# Altium schematic sheet 03. MCU.SchDoc
size A4
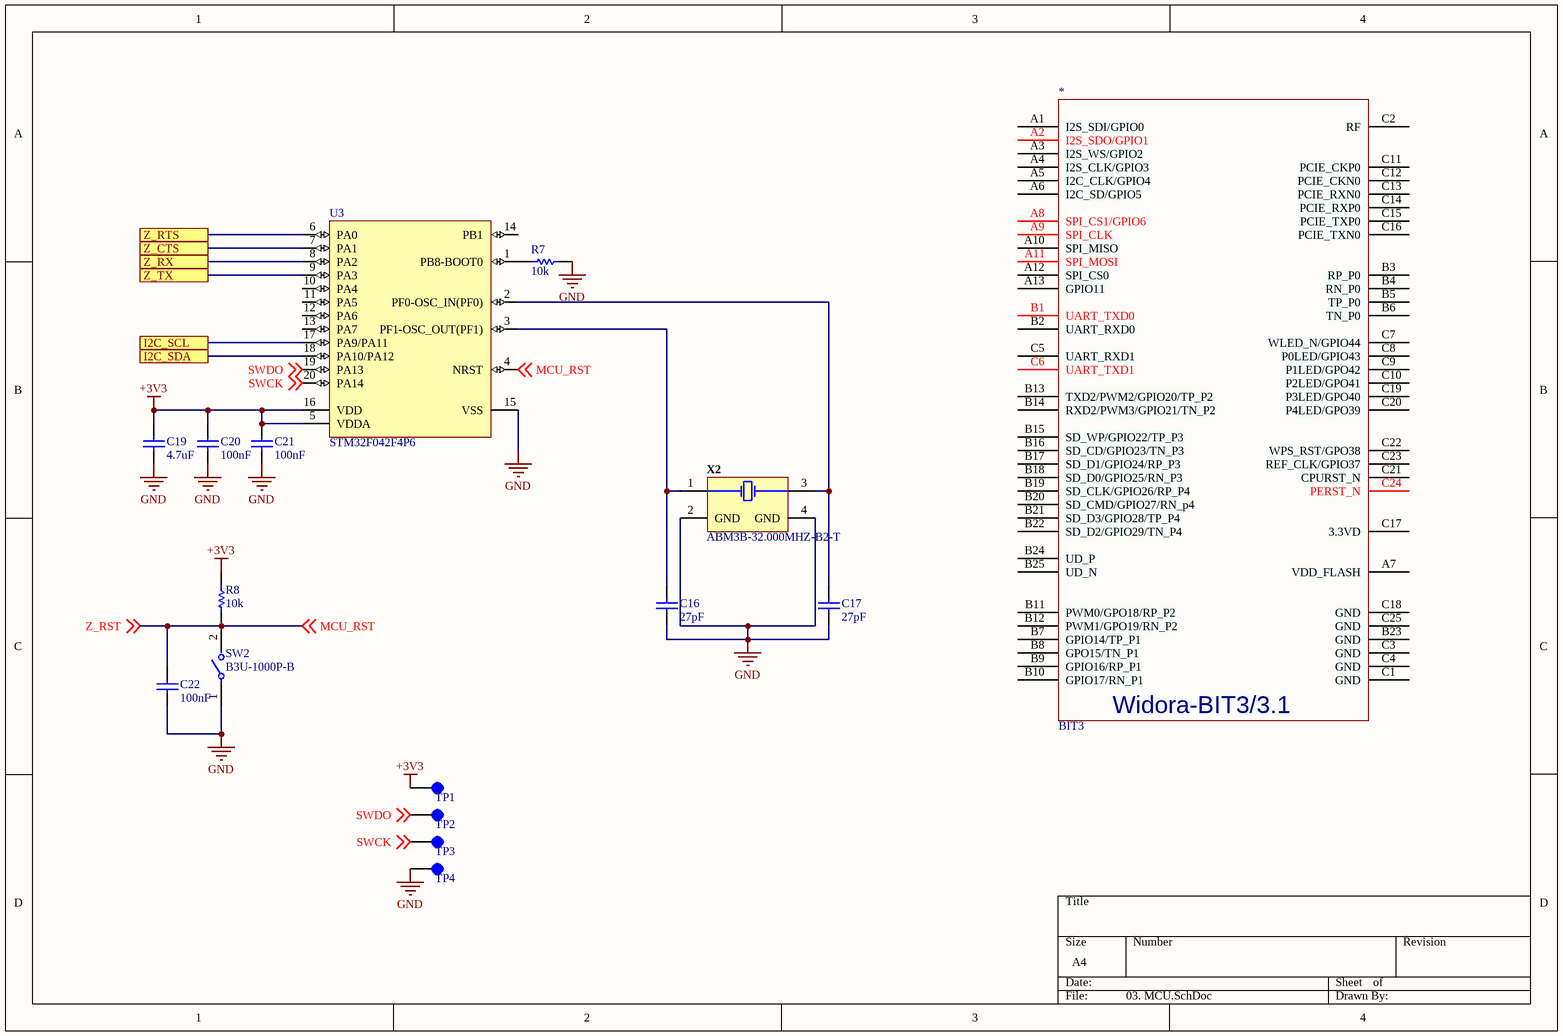
[diagram p0: 03. MCU.SchDoc]

## Parts
*  BIT3  [Widora-BIT3]
C16  27pF  [CAPC1005X56X25NL10T15]
C17  27pF  [CAPC1005X56X25NL10T15]
C19  4.7uF  [CAPC1608X90X35NL10T15]
C20  100nF  [CAPC1005X56X25NL10T15]
C21  100nF  [CAPC1005X56X25NL10T15]
C22  100nF  [CAPC1005X56X25NL10T15]
R7  10k  [RESC1005X40X25NL05T05]
R8  10k  [RESC1005X40X25NL05T05]
SW2  B3U-1000P-B  [FP-B3U-1000P-B-MFG]
TP1  Test Point  [TP]  (value not drawn)
TP2  Test Point  [TP]  (value not drawn)
TP3  Test Point  [TP]  (value not drawn)
TP4  Test Point  [TP]  (value not drawn)
U3  STM32F042F4P6  [STM-TSSOP20_M]
X2  ABM3B-32.000MHZ-B2-T  [ABRA-ABM3B_V]

## Ports
I2C_SCL, I2C_SDA, Z_CTS, Z_RTS, Z_RX, Z_TX

## Nets
+3V3: C19.2 C20.2 C21.2 R8.1 TP1.1 U3.5(VDDA) U3.16(VDD)
GND: C16.1 C17.1 C19.1 C20.1 C21.1 C22.1 R7.1 SW2.1 TP4.1 U3.15(VSS) X2.2(GND) X2.4(GND)
I2C_SCL: U3.17(PA9/PA11) ; port I2C_SCL
I2C_SDA: U3.18(PA10/PA12) ; port I2C_SDA
MCU_RST: C22.2 R8.2 SW2.2 U3.4(NRST) ; off-sheet MCU_RST, off-sheet Z_RST  [also labelled Z_RST]
SWCK: TP3.1 U3.20(PA14) ; off-sheet SWCK
SWDO: TP2.1 U3.19(PA13) ; off-sheet SWDO
Z_CTS: U3.7(PA1) ; port Z_CTS
Z_RTS: U3.6(PA0) ; port Z_RTS
Z_RX: U3.8(PA2) ; port Z_RX
Z_TX: U3.9(PA3) ; port Z_TX
NetC16_2: C16.2 U3.3(PF1-OSC_OUT(PF1)) X2.1(X1)
NetC17_2: C17.2 U3.2(PF0-OSC_IN(PF0)) X2.3(X2)
NetR7_2: R7.2 U3.1(PB8-BOOT0)

Not connected (* = marked no-connect by the designer): * A1(I2S_SDI/GPIO0) A2(I2S_SDO/GPIO1) A3(I2S_WS/GPIO2) A4(I2S_CLK/GPIO3) A5(I2C_CLK/GPIO4) A6(I2C_SD/GPIO5) A7(VDD_FLASH) A8(SPI_CS1/GPIO6) A9(SPI_CLK) A10(SPI_MISO) A11(SPI_MOSI) A12(SPI_CS0) A13(GPIO11) B1(UART_TXD0) B2(UART_RXD0) B3(RP_P0) B4(RN_P0) B5(TP_P0) B6(TN_P0) B7(GPIO14/TP_P1) B8(GPO15/TN_P1) B9(GPIO16/RP_P1) B10(GPIO17/RN_P1) B11(PWM0/GPO18/RP_P2) B12(PWM1/GPO19/RN_P2) B13(TXD2/PWM2/GPIO20/TP_P2) B14(RXD2/PWM3/GPIO21/TN_P2) B15(SD_WP/GPIO22/TP_P3) B16(SD_CD/GPIO23/TN_P3) B17(SD_D1/GPIO24/RP_P3) B18(SD_D0/GPIO25/RN_P3) B19(SD_CLK/GPIO26/RP_P4) B20(SD_CMD/GPIO27/RN_p4) B21(SD_D3/GPIO28/TP_P4) B22(SD_D2/GPIO29/TN_P4) B23(GND) B24(UD_P) B25(UD_N) C1(GND) C2(RF) C3(GND) C4(GND) C5(UART_RXD1) C6(UART_TXD1) C7(WLED_N/GPIO44) C8(P0LED/GPIO43) C9(P1LED/GPO42) C10(P2LED/GPO41) C11(PCIE_CKP0) C12(PCIE_CKN0) C13(PCIE_RXN0) C14(PCIE_RXP0) C15(PCIE_TXP0) C16(PCIE_TXN0) C17(3.3VD) C18(GND) C19(P3LED/GPO40) C20(P4LED/GPO39) C21(CPURST_N) C22(WPS_RST/GPO38) C23(REF_CLK/GPIO37) C24(PERST_N) C25(GND); U3 10(PA4) 11(PA5) 12(PA6) 13(PA7) 14(PB1)

## Notes on the sheet
- (in symbol BIT3) Widora-BIT3/3.1

## Library data of the parts
C16 C17 = CMP-2008-02620-1: Part Number: 04025A270FAT2A; Manufacturer: AVX Interconnect / Elco
C19 = CMP-2006-02545-1: Part Number: GRM188R6YA475KE15D; Manufacturer: Murata
C20-C22 = CMP-2008-02743-1: Manufacturer: AVX Interconnect / Elco; Part Number: 04026D104KAT2A
R7 R8 = CMP-2000-07588-1: Chip Resistor, 10 KOhm, +/- 1%, 0.1 W, -55 to 155 degC, 0402 (1005 Metric), RoHS, Tape and Reel; Manufacturer: Panasonic; Power Rating: 100mW; Voltage Rating: 50V; Resistance: 10KOhm; Case\/Package: 0402; Temperature Coefficient: 100ppm\/degreesC; RoHSCompliant: True; Lead Free: LeadFree; Package Quantity: 1; Contact Plating: Tin; Length: 1mm; Radiation Hardening: No; REACH SVHC: NoSVHC; Max Operating Temperature: 155degC; Depth: 0.5mm; Case Code (Imperial): 0402; Military Standard: Not; Package Description: 2-Pin Surface Mount Device, Body 1 x 0.5 mm; Termination: SMD/SMT; Case Code (Metric): 1005; Height: 0.35mm; Packaging: TapeandReel; Voltage Rating (DC): 50V; Package Reference: 402; Number of Pins: 2; Tolerance: 1%; Mounting Technology: SurfaceMount; Width: 0.02inch; Mount: SurfaceMount; Datasheet URL: https://industrial.panasonic.com/cdbs/www-data/pdf/RDA0000/AOA0000C304.pdf; Composition: ThickFilm; Datasheet Version: 02/2017; Manufacturer URL: http://www.panasonic.com/; Max Power Dissipation: 100mW; Number of Terminations: 2; Min Operating Temperature: -55degC
SW2 = CMP-08834-000005-1: SWITCH TACTILE SPST-NO 0.05A 12V; Manufacturer: Omron; Operating Force: 1.5N; Contact Current Rating: 50mA; Contact Resistance: 100mΩ; Electromechanical Life: 200000Cycles; Height: 1.75mm; Device Class L2: Switches; Temperature Range High: +70°C; Digikey Description: SWITCH TACTILE SPST-NO 0.05A 12V; Throw Configuration: SPST-NO; Ambient Temperature Range High: +70°C; Temperature: -25°C to +70°C; Lead Free: Yes; ComponentLink2URL: https://omronfs.omron.com/en_US/ecb/products/pdf/en-b3u.pdf; Device Class L3: Tactile Switches; Manufacturer Part Number: B3U-1000P-B; Ambient Temperature Range Low: -25°C; Mount: Surface Mount; Automotive: No; Mouser Description: Tactile Switches Top Actuated with boss w/o ground; Octopart: https://octopart.com/b3u-1000p-b-omron-1057356; RoHS: TRUE; Package: 0; Device Class L1: Electromechanical; Voltage Rating Dc: 12V; Category: Switch; Temperature Range Low: -25°C; ComponentLink2Description: Datasheet
TP1-TP4 = TP
U3 = CMP-0304-00106-2: ARM Cortex-M0 32-bit MCU, 16 KB Flash, 6 KB Internal RAM, 16 I/Os, 20-Pin TSSOP, -40 to 85 degC, Tray; Manufacturer: STMicroelectronics; Supply Voltage(Vcc) min (V): 2; Operating Frequency(F) (Processor speed) (MHz): 48; Internal RAM Size (kB): 6; FLASH Size (Prog) (kB): 16; PartNumber: STM32F042F4P6; DatasheetVersion: Rev. 5; Package Reference: TSSOP20; Packing: Tray; ComponentLink2URL: http://www.st.com/st-web-ui/static/active/en/resource/technical/document/datasheet/DM00105814.pdf; Core: ARM Cortex-M0; ComponentLink2Description: Datasheet; ComponentLink1URL: http://www.st.com/; Package Description: 20-Pin Thin Shrink Small Outline Package, Body 6.5 x 4.4 mm, Pitch 0.65 mm; Mounting Technology: Surface Mount; ComponentLink1Description: Manufacturer URL; I/Os (High Current): 16
X2 = CMP-1688-00002-1: Ceramic SMD Crystal, 8 MHz, +/- 20 ppm, 200 Ohm, -20 to 70 degC, 4-Pin SMD, RoHS, Tape and Reel; Max Supply Voltage: 45 V; Outputs: 4; Min Supply Voltage: 8.2 V; Output Voltage: 3.3 V; Switching Frequency: 30 KHz; Output Current: 1.8 A; Packaging: Rail/Tube; ComponentLink2Description: Datasheet; REACH SVHC: No SVHC; ComponentLink1URL: http://www.abracon.com/; PackageReference: ABM3B; Weight: 0.004233 oz; Height: 1.05 mm; ComponentLink2URL: http://www.abracon.com/Resonators/abm3b.pdf; Mount: Surface Mount; Min Operating Temperature: -40 degC; Max Operating Temperature: 85 degC; Package Quantity: 50; PackageDescription: 4-Pin Surface Mount Device, Body 5 x 3.2 mm; Pins: 28; DatasheetVersion: Aug-15; ComponentLink1Description: Manufacturer URL; RoHSCompliant: true; Radiation Hardening: No; Length: 9.8 mm; Width: 4.5 mm